# EAGLE design SERV (EAGLE 9.4.2)
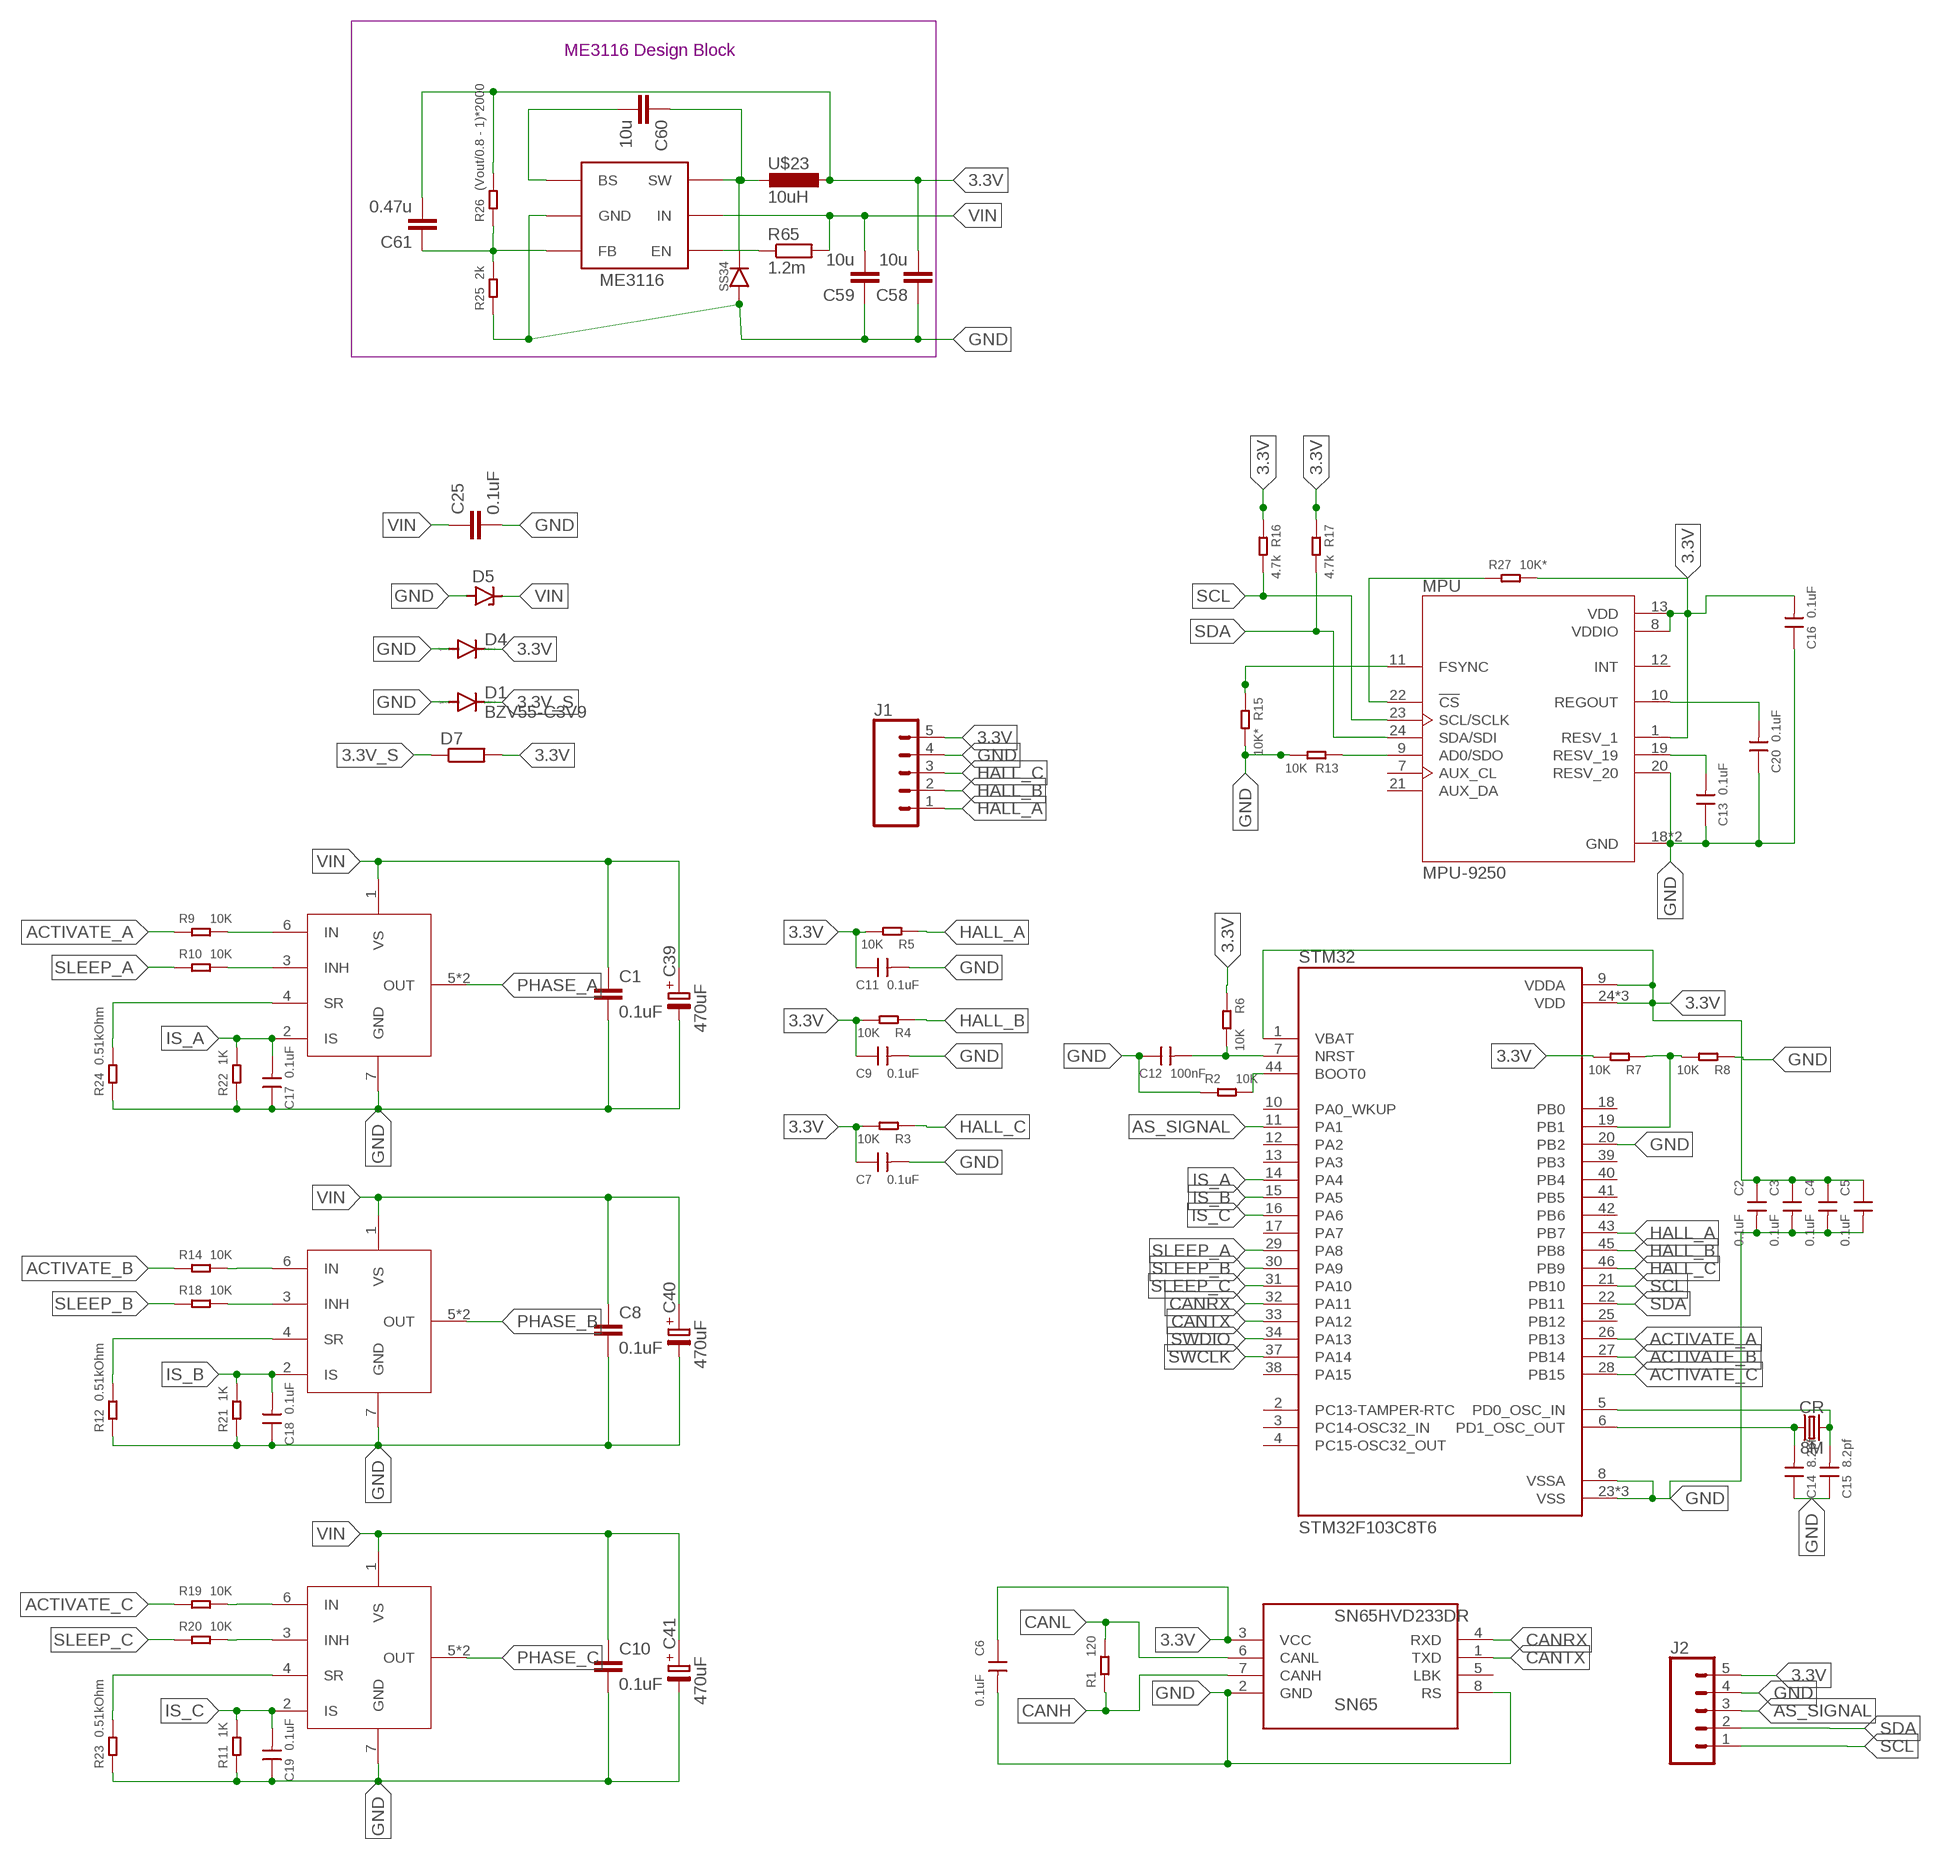
[diagram p0: schematic, sheet 1]

## Parts
BTN_A  BTN7960B  [DPAK127P1500X440-8N]
BTN_B  BTN7960B  [DPAK127P1500X440-8N]
BTN_C  BTN7960B  [DPAK127P1500X440-8N]
C1  0.1uF  C-EUC1206  [C1206]
C2  0.1uF  C-0603  [0603]
C3  0.1uF  C-0603  [0603]
C4  0.1uF  C-0603  [0603]
C5  0.1uF  C-0603  [0603]
C6  0.1uF  C-0603  [0603]
C7  0.1uF  C-0603  [0603]
C8  0.1uF  C-EUC1206  [C1206]
C9  0.1uF  C-0603  [0603]
C10  0.1uF  C-EUC1206  [C1206]
C11  0.1uF  C-0603  [0603]
C12  100nF  C-0603  [0603]
C13  0.1uF  C-0603  [0603]
C14  8.2pf  C-0603  [0603]
C15  8.2pf  C-0603  [0603]
C16  0.1uF  C-0603  [0603]
C17  0.1uF  C-0603  [0603]
C18  0.1uF  C-0603  [0603]
C19  0.1uF  C-0603  [0603]
C20  0.1uF  C-0603  [0603]
C25  0.1uF  C-EUC1206  [C1206]
C39  470uF  C-PR-SMD-TE-D  [TE-D-7343]
C40  470uF  C-PR-SMD-TE-D  [TE-D-7343]
C41  470uF  C-PR-SMD-TE-D  [TE-D-7343]
C58  10u  C-EUC0805  [C0805]
C59  10u  C-EUC0805  [C0805]
C60  10u  C-EUC0805  [C0805]
C61  0.47u  C-EUC0805  [C0805]
CR  8M  CRYSTALSMD-3.2X2.5  [CRYSTAL-SMD-3.2X2.5MM]
D1  BZV55-C3V9  DIODE-MINIMELF  [MINIMELF]
D4  DIODE-MINIMELF  [MINIMELF]
D5  ZENER-DIODESMB  [SMB]
D7  R-EU_R0805W  [R0805W]
J1  CONN_05  [1X05]
J2  CONN_05  [1X05]
ME311  ME3116  [SOT-23-6]
MPU  MPU-9250  [QFN40P300X300X105-24N]
R1  120  R-0603  [0603]
R2  10K  R-0603  [0603]
R3  10K  R-0603  [0603]
R4  10K  R-0603  [0603]
R5  10K  R-0603  [0603]
R6  10K  R-0603  [0603]
R7  10K  R-0603  [0603]
R8  10K  R-0603  [0603]
R9  10K  R-0603  [0603]
R10  10K  R-0603  [0603]
R11  1K  R-0603  [0603]
R12  0.51kOhm  R-0603  [0603]
R13  10K  R-0603  [0603]
R14  10K  R-0603  [0603]
R15  10K*  R-0603  [0603]
R16  4.7k  R-0603  [0603]
R17  4.7k  R-0603  [0603]
R18  10K  R-0603  [0603]
R19  10K  R-0603  [0603]
R20  10K  R-0603  [0603]
R21  1K  R-0603  [0603]
R22  1K  R-0603  [0603]
R23  0.51kOhm  R-0603  [0603]
R24  0.51kOhm  R-0603  [0603]
R25  2k  R-0603  [0603]
R26  (Vout/0.8 - 1)*2000  R-0603  [0603]
R27  10K*  R-0603  [0603]
R65  1.2m  R-EU_R0603  [R0603]
SN65  SN65HVD233DR  [SOIC8]
STM32  STM32F103C8T6  [QFP50P900X900X160-48N]
U$1  SMA-SS34  [SMA-SS34]
U$23  10uH  INDUCTOR_CD43  [CD43]

## Nets
3.3V: C2.1 C3.1 C4.1 C5.1 C6.1 C7.1 C9.1 C11.1 C16.2 C58.2 C61.2 D4.C D7.2 J1.5 J2.5 MPU.1(RESV_1) MPU.8(VDDIO) MPU.13(VDD) R3.2 R4.2 R5.2 R6.1 R7.2 R16.1 R17.1 R26.2 R27.2 SN65.3(VCC) STM32.1(VBAT) STM32.9(VDDA) STM32.24(VDD) STM32.36(VDD) STM32.48(VDD) U$23.P$1
3.3V_S: D1.C D7.1
ACTIVATE_A: R9.1 STM32.26(PB13)
ACTIVATE_B: R14.1 STM32.27(PB14)
ACTIVATE_C: R19.1 STM32.28(PB15)
AS_SIGNAL: J2.3 STM32.11(PA1)
CANH: R1.1 SN65.7(CANH)
CANL: R1.2 SN65.6(CANL)
CANRX: SN65.4(RXD) STM32.32(PA11)
CANTX: SN65.1(TXD) STM32.33(PA12)
GND: BTN_A.7(GND) BTN_B.7(GND) BTN_C.7(GND) C1.2 C2.2 C3.2 C4.2 C5.2 C6.2 C7.2 C8.2 C9.2 C10.2 C11.2 C12.1 C13.1 C14.1 C15.1 C16.1 C17.1 C18.1 C19.1 C20.1 C25.2 C39.- C40.- C41.- C58.1 C59.1 D1.A D4.A D5.A J1.4 J2.4 ME311.2(GND) MPU.18(GND) MPU.20(RESV_20) MPU.25(GND) R2.1 R8.1 R11.1 R12.1 R13.2 R15.2 R21.1 R22.1 R23.1 R24.1 R25.1 SN65.2(GND) SN65.8(RS) STM32.8(VSSA) STM32.20(PB2) STM32.23(VSS) STM32.35(VSS) STM32.47(VSS) U$1.1(IN)
HALL_A: J1.1 R5.1 STM32.43(PB7)
HALL_B: J1.2 R4.1 STM32.45(PB8)
HALL_C: J1.3 R3.1 STM32.46(PB9)
IS_A: BTN_C.2(IS) C17.2 R22.2 STM32.14(PA4)
IS_B: BTN_B.2(IS) C18.2 R21.2 STM32.15(PA5)
IS_C: BTN_A.2(IS) C19.2 R11.2 STM32.16(PA6)
N$1: MPU.9(AD0/SDO) R13.1
N$2: R2.2 STM32.44(BOOT0)
N$3: C20.2 MPU.10(REGOUT)
N$4: MPU.22(!CS) R27.1
N$26: BTN_C.4(SR) R24.2
N$27: BTN_B.6(IN) R14.2
N$28: BTN_B.4(SR) R12.2
N$29: BTN_A.6(IN) R19.2
N$30: BTN_A.4(SR) R23.2
N$31: BTN_B.3(INH) R18.2
N$37: BTN_A.3(INH) R20.2
N$38: C13.2 MPU.19(RESV_19)
N$48: MPU.11(FSYNC) R15.1
N$51: C15.2 CR.3 STM32.5(PD0_OSC_IN)
N$52: C14.2 CR.1 STM32.6(PD1_OSC_OUT)
N$54: C12.2 R6.2 STM32.7(NRST)
N$56: BTN_C.6(IN) R9.2
N$57: BTN_C.3(INH) R10.2
N$61: R7.1 R8.2 STM32.19(PB1)
N$62: C60.2 ME311.1(BS)
N$63: C61.1 ME311.3(FB) R25.2 R26.1
N$64: ME311.4(EN) R65.1
N$66: C60.1 ME311.6(SW) U$1.2(OUT) U$23.P$2
PHASE_A: BTN_C.5(OUT) BTN_C.8(OUT)
PHASE_B: BTN_B.5(OUT) BTN_B.8(OUT)
PHASE_C: BTN_A.5(OUT) BTN_A.8(OUT)
SCL: J2.1 MPU.23(SCL/SCLK) R16.2 STM32.21(PB10)
SDA: J2.2 MPU.24(SDA/SDI) R17.2 STM32.22(PB11)
SLEEP_A: R10.1 STM32.29(PA8)
SLEEP_B: R18.1 STM32.30(PA9)
SLEEP_C: R20.1 STM32.31(PA10)
SWCLK: STM32.37(PA14)
SWDIO: STM32.34(PA13)
VIN: BTN_A.1(VS) BTN_B.1(VS) BTN_C.1(VS) C1.1 C8.1 C10.1 C25.1 C39.+ C40.+ C41.+ C59.2 D5.C ME311.5(IN) R65.2
Unconnected: MPU.7(AUX_CL) MPU.12(INT) MPU.21(AUX_DA) SN65.5(LBK) STM32.2(PC13-TAMPER-RTC) STM32.3(PC14-OSC32_IN) STM32.4(PC15-OSC32_OUT) STM32.10(PA0_WKUP) STM32.12(PA2) STM32.13(PA3) STM32.17(PA7) STM32.18(PB0) STM32.25(PB12) STM32.38(PA15) STM32.39(PB3) STM32.40(PB4) STM32.41(PB5) STM32.42(PB6)

## Notes on the sheet
- Фитолента
- ME3116 Design Block

## Library data of the parts
BTN_A BTN_B BTN_C = DDPAK127P1500X440-8N:BTN7960B
C1 C8 C10 C25 C58-C61 = resistor:C-EU: CAPACITOR, European symbol
C2-C7 C9 C11-C20 = discrete:C*: Ceramic Capacitors
C39-C41 = cap-pan40:C-PR: POLARIZED ELECTROLYTIC/TANTALUM
CR = SparkFun-Clocks:CRYSTAL: Crystals (Generic) These are passive quartz crystals, which can be used as a clock source for a microcontroller. Crystal's are two-terminal devices. They require external "load" capacitors to generate an oscillating signal.
D1 D4 = diode:DIODE-: DIODE
D5 = diode:ZENER-DIODE: Z-Diode
D7 R65 = resistor:R-EU_: RESISTOR, European symbol
J1 J2 = SparkFun-Connectors:CONN_05: Multi connection point. Often used as Generic Header-pin footprint for 0.1 inch spaced/style header connections On any of the 0.1 inch spaced packages, you can populate with these: Break Away Headers - Straight <https://www.sparkfun.com/products/116> (PRT-00116) Break Away Male Headers - Right Angle <https://www.sparkfun.com/products/553> (PRT-00553) Female Headers <https://www.sparkfun.com/products/115> (PRT-00115) Break Away Headers - Machine Pin <https://www.sparkfun.com/products/117> (PRT-00117) Break Away Female Headers - Swiss Machine Pin <https://www.sparkfun.com/products/743> (PRT-00743) For SCREWTERMINALS and SPRING TERMINALS visit here: Screw Terimnals on SparkFun.com <https://www.sparkfun.com/search/results?term=Screw+Terminals> (5mm/3.5mm/2.54mm spacing) This device is also useful as a general connection point to wire up your design to another part of your project. Our various solder wires solder well into these plated through hole pads. Hook-Up Wire - Assortment (Stranded, 22 AWG) <https://www.sparkfun.com/products/11375> (PRT-11375) Hook-Up Wire - Assortment (Solid Core, 22 AWG) <https://www.sparkfun.com/products/11367> (PRT-11367) View the entire wire category on our website here <https://www.sparkfun.com/categories/141> Special notes: Molex polarized connector foot print use with SKU : PRT-08231 with associated crimp pins and housings. 1MM SMD Version SKU: PRT-10208
ME311 = ME3116:ME3116
MPU = MPU-9250:MPU-9250: Axis=3 Axis Gyro+3 Axis Accel+Compass. Pin For Pin With m; AVAILABILITY: Unavailable; DESCRIPTION: Accelerometer, Gyroscope, Magnetometer, 9 Axis Sensor I²C, SPI Output; MF: TDK InvenSense; MP: MPU-9250; PACKAGE: TFQFN-24 TDK InvenSense; PRICE: None
R1-R27 = discrete:R*
SN65 = SN65HVD233DR:SN65HVD233DR; AVAILABILITY: Unavailable; DESCRIPTION: 3.3V CAN Transceiver with Standby Mode, Loop-back 8-SOIC -40 to 125; MF: Texas Instruments; MP: SN65HVD233DR; PACKAGE: SOIC-8 Texas Instruments; PRICE: None
STM32 = STM32F103C8T6:STM32F103C8T6: Mainstream Performance line, ARM Cortex-M3 MCU with 64 Kbytes Flash, 72 MHz CPU, motor control, USB and CAN; AVAILABILITY: Unavailable; DESCRIPTION: ARM® Cortex®-M3 STM32F1 Microcontroller IC 32-Bit 72MHz 64KB _64K x 8_ FLASH; MF: STMicroelectronics; MP: STM32F103C8T6; PACKAGE: LQFP-48 STMicroelectronics; PRICE: None
U$1 = SMA-SS34:SMA-SS34
U$23 = inductor_cd43:INDUCTOR_CD43

## Board
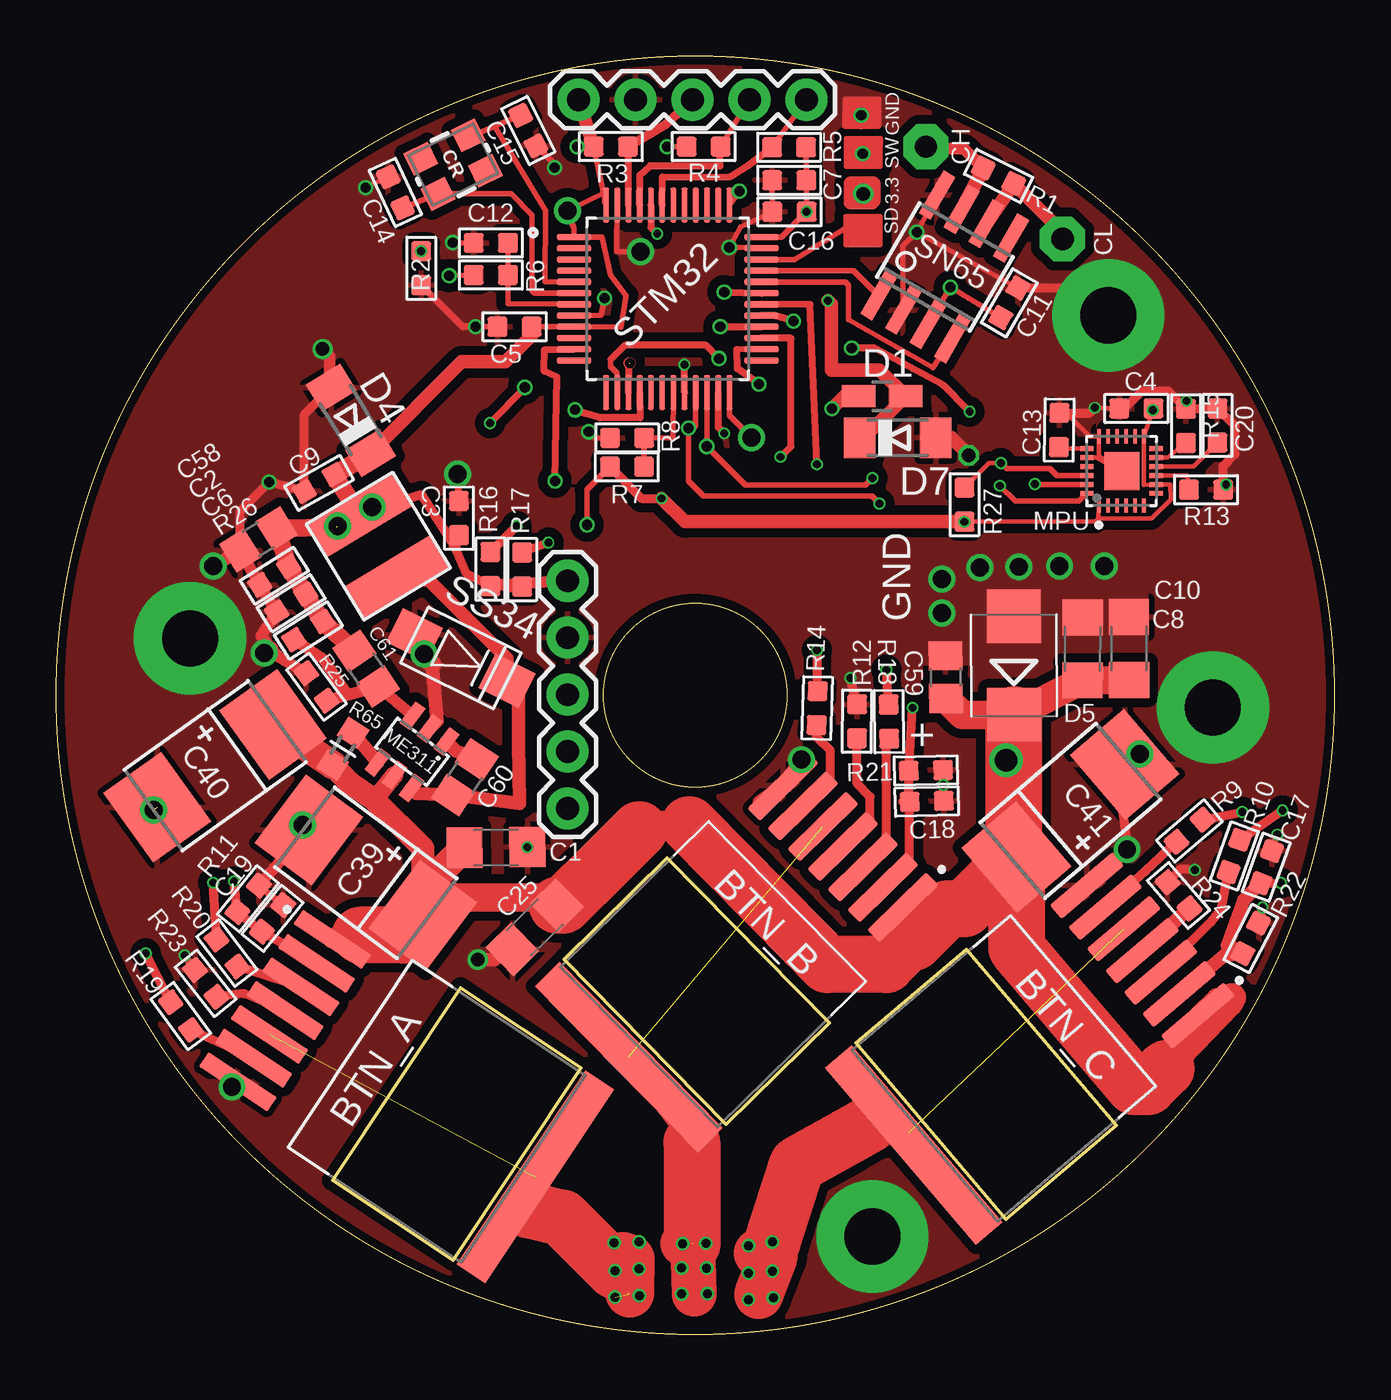
[diagram p1: board, top side]
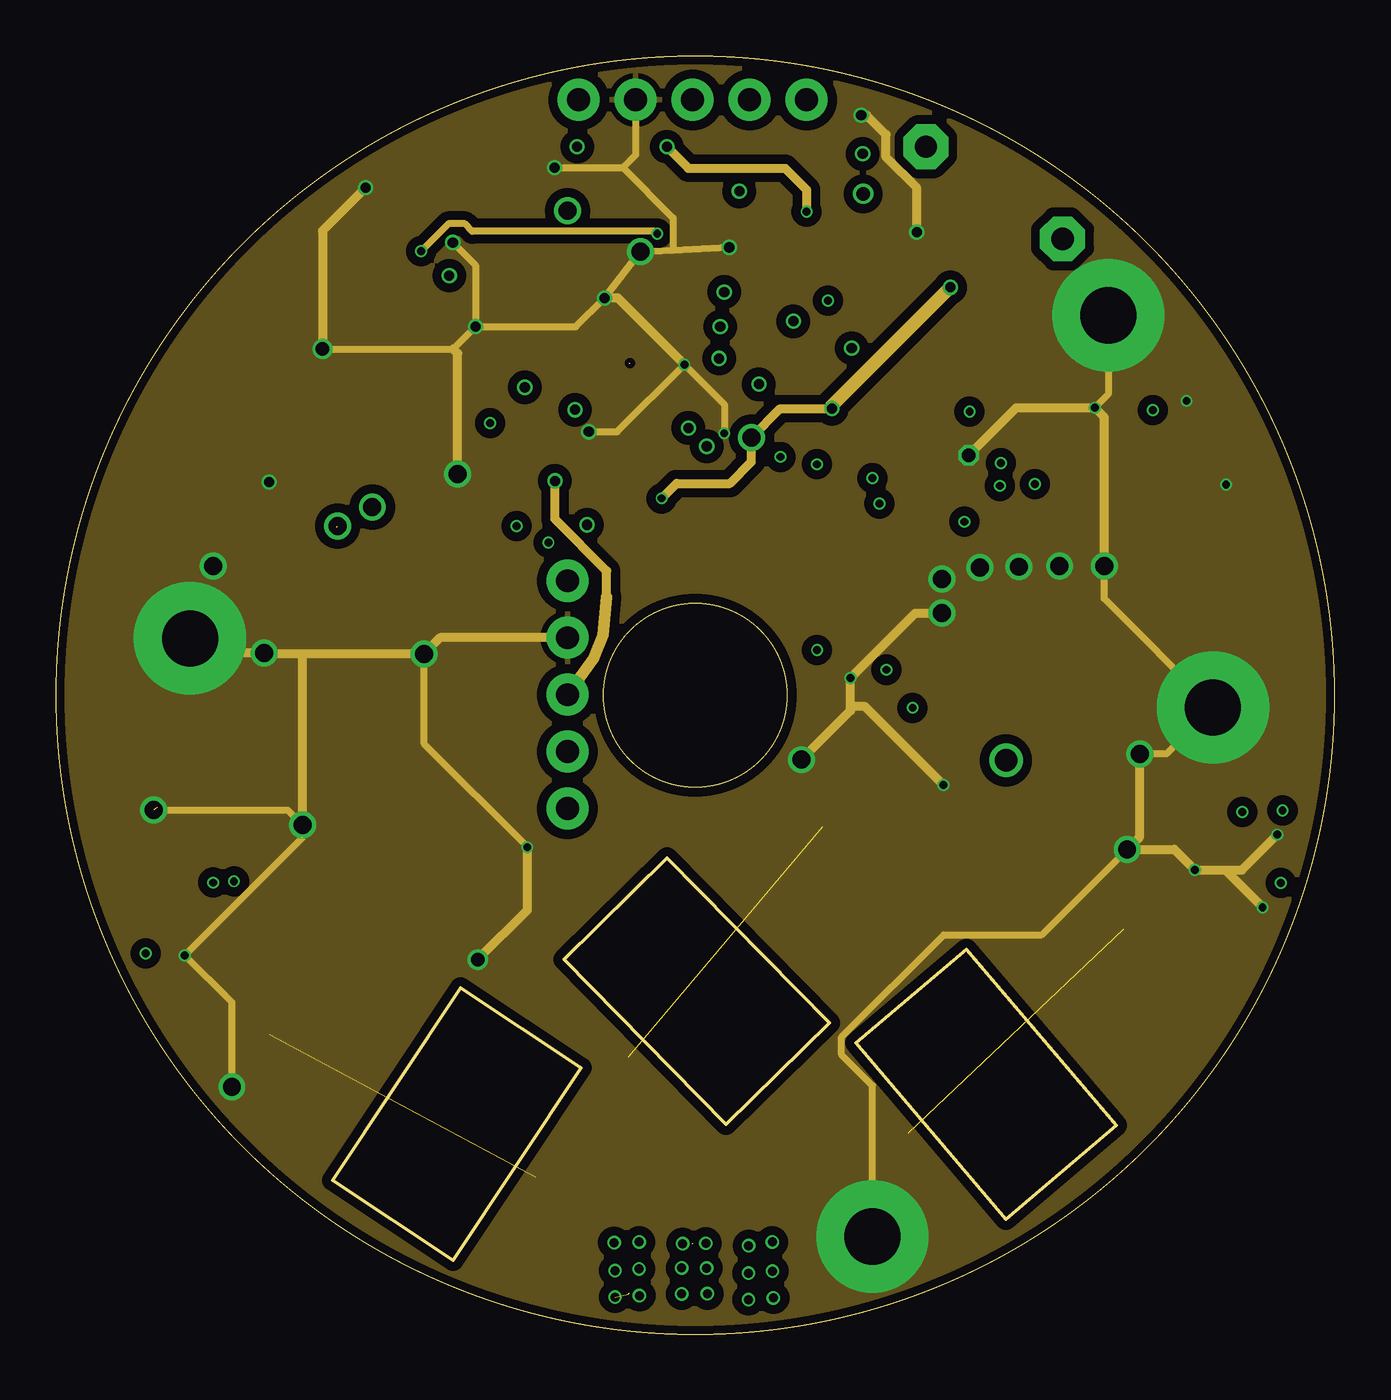
[diagram p2: board, inner layer Route2]
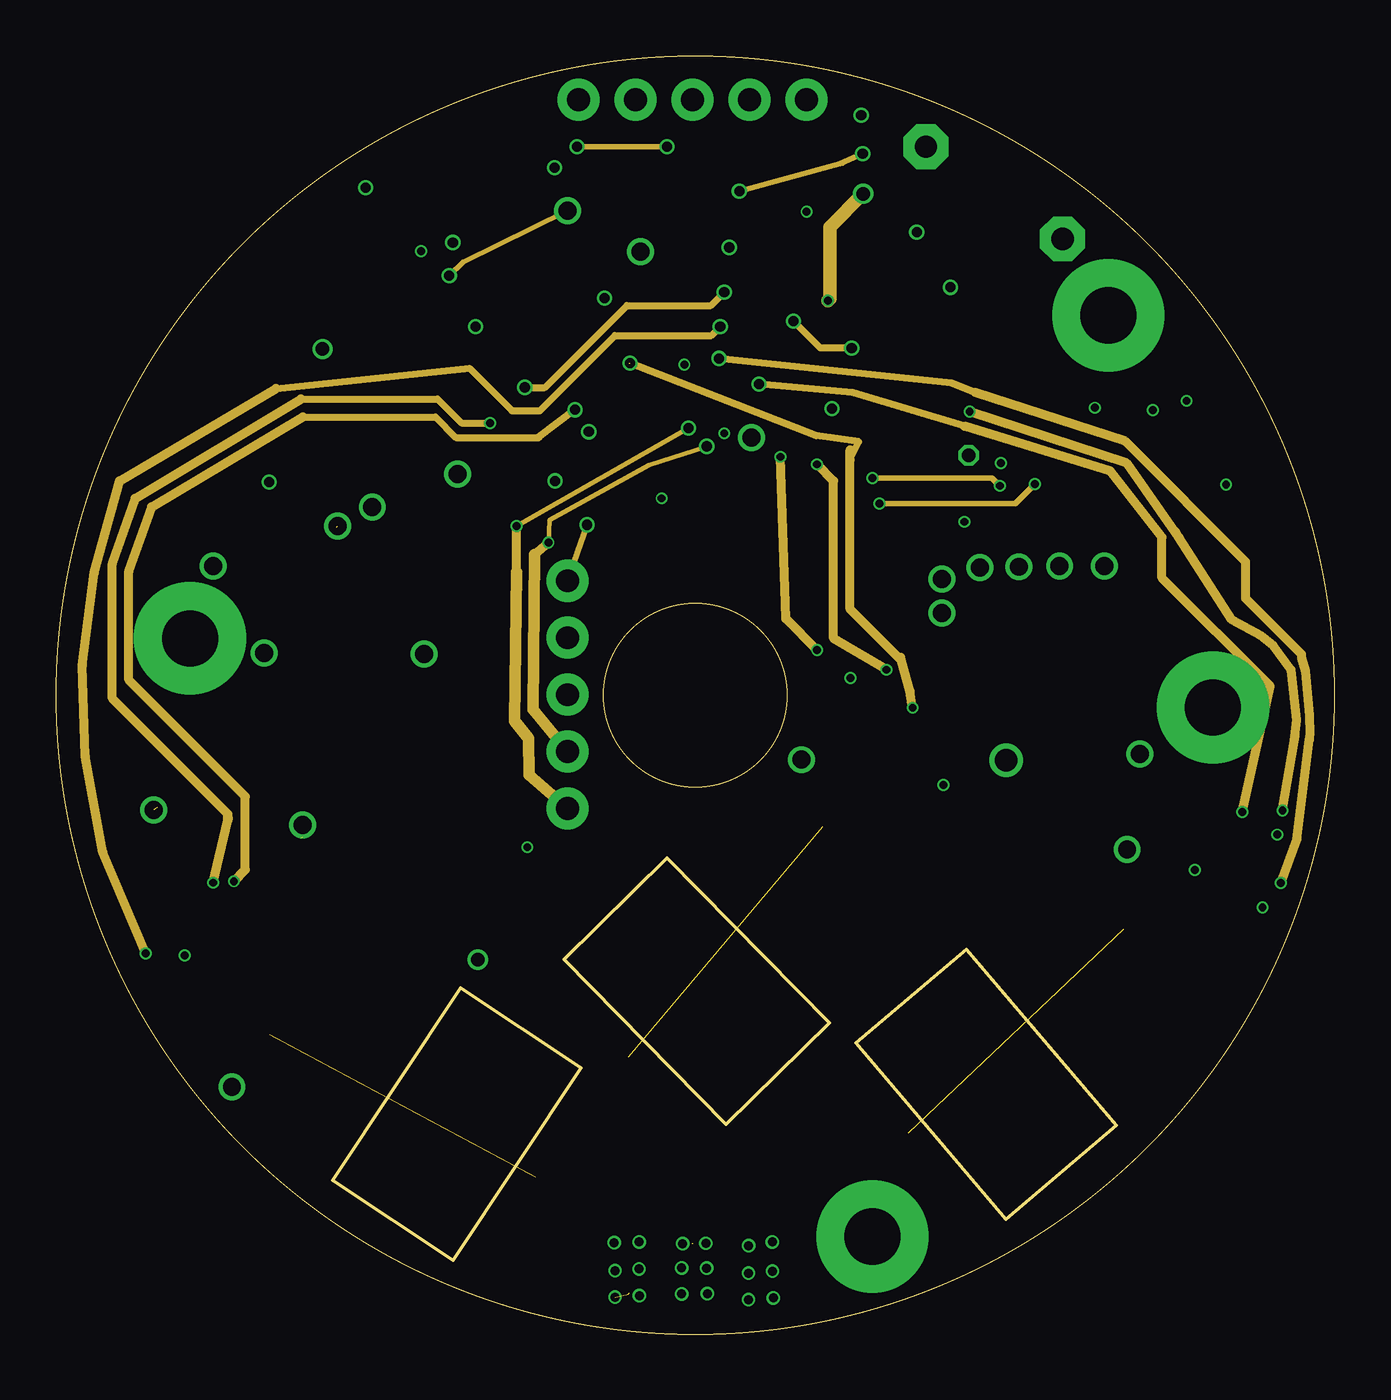
[diagram p3: board, inner layer Route15]
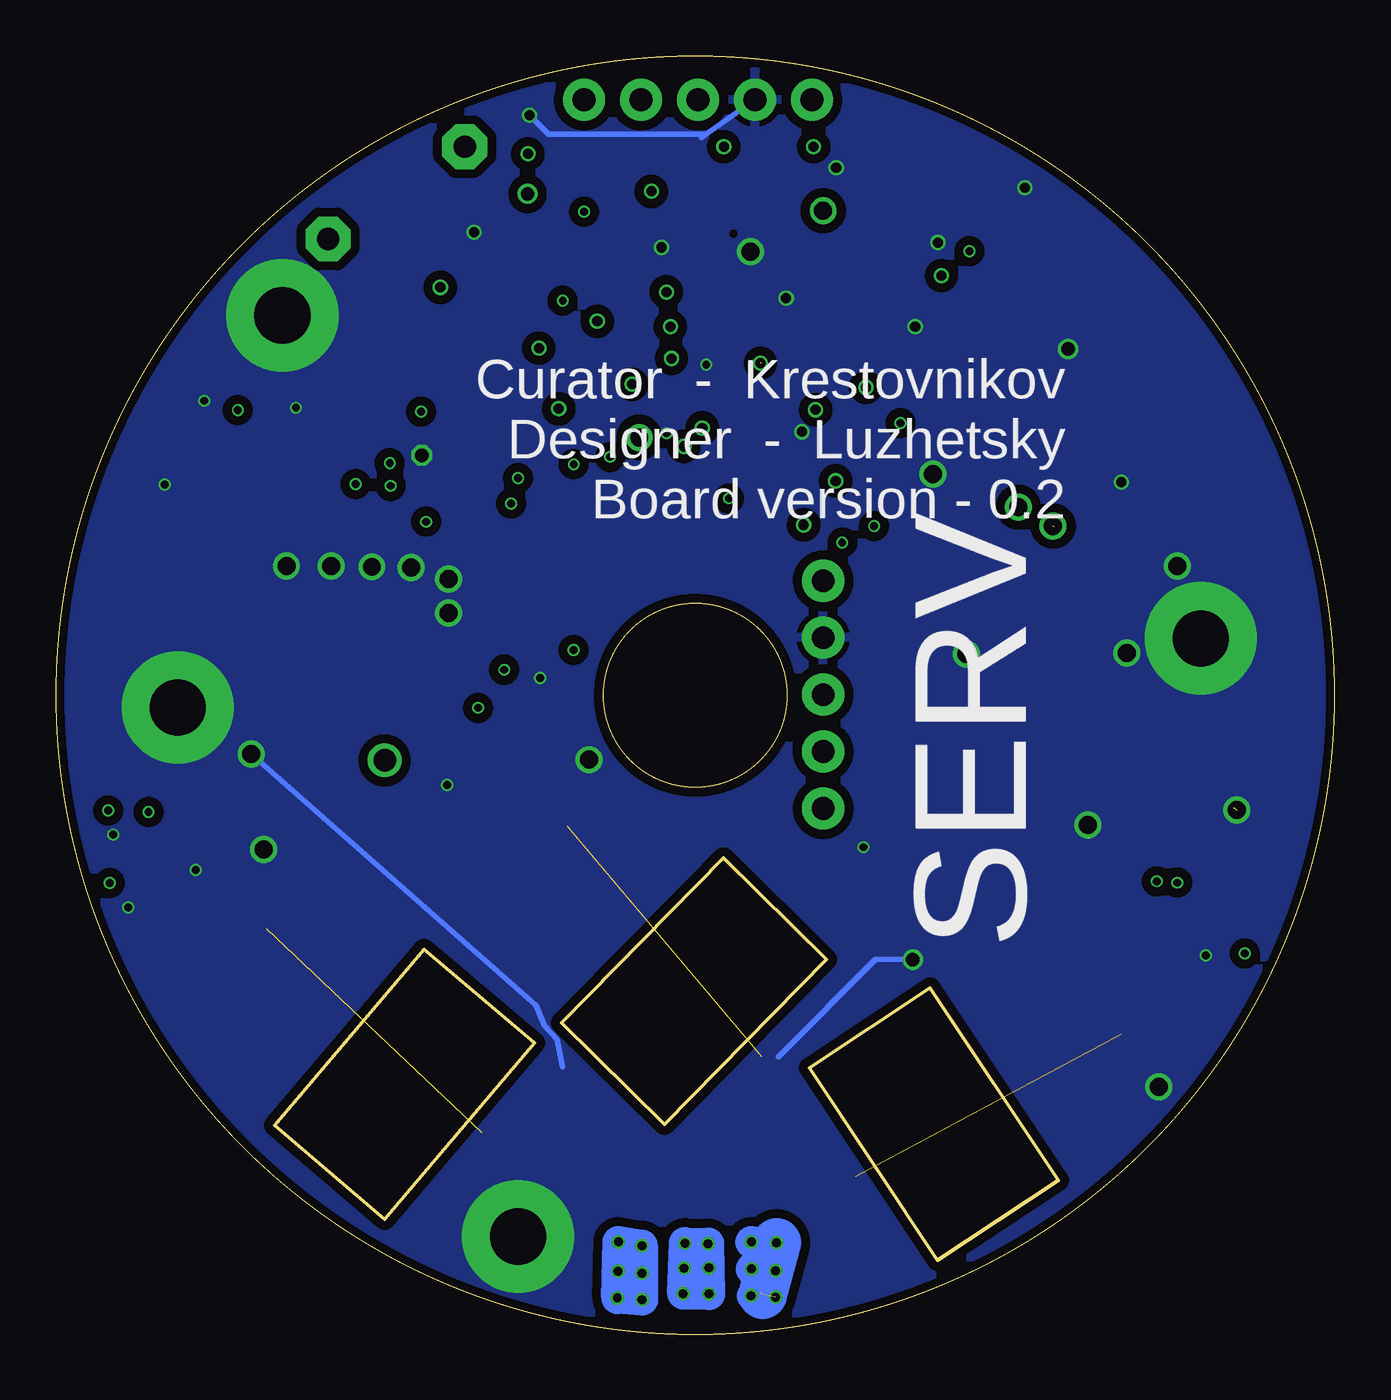
[diagram p4: board, bottom side, seen from below]

Size 57 x 57 mm. Coordinates in mm from the lower left corner, seen from the top.
Outline: circle at 28.5,28.5 radius 4.1
Outline: circle at 28.5,28.5 radius 28.5
Copper layers (1*2*15*16): Top 0.035mm / dielectric 1.6mm / Route2 0.035mm / dielectric 0.15mm / Route15 0.035mm / dielectric 0.2mm / Bottom 0.035mm
Design rules "jlcpcb": minimum track width 5mil, minimum drill 0.2mm, track to track 5mil, track to pad 5mil, pad to pad 5mil, via to via 5mil, smd to smd 0mil, copper to edge 0.4mm, drill to drill 8mil, minimum pad ring 0.075mm, minimum via ring 0.075mm, stop-mask expansion 4mil, vias tented up to drill 0mil, thermal gap 10mil

### Footprints (pad centres in the part's own frame; a part is rotated, then mirrored left to right if it is on the bottom)
DPAK127P1500X440-8N = smd 3.67 x 0.79: 1 -6.07,3.81; 2 -6.07,2.54; 3 -6.07,1.27; 4 -6.07,0; 5 -6.07,-1.27; 6 -6.07,-2.54; 7 -6.07,-3.81 | smd 1.538 x 10.37: 8 7.319,0
C1206 = smd 1.6 x 1.8: 1 -1.4,0; 2 1.4,0
0603 = smd 0.889 x 0.889: 1 -0.762,0; 2 0.762,0
TE-D-7343 = smd 3.175 x 3.81: + 3.175,0; - -3.175,0
C0805 = smd 1.3 x 1.5: 1 -0.95,0; 2 0.95,0
CRYSTAL-SMD-3.2X2.5MM = smd 1.2 x 1.1: 1 -1.175,-0.875; 2 1.175,-0.875; 3 1.175,0.875; 4 -1.175,0.875
MINIMELF = smd 1.4 x 1.8: A 1.7,0; C -1.7,0
SMB = smd 2.4 x 2.4: A 2.2,0; C -2.2,0
R0805W = smd 1.5 x 1: 1 -1.052,0; 2 1.052,0
1X05 = drill 1.016 pad 1.88: 1 0,0; 2 2.54,0; 3 5.08,0; 4 7.62,0; 5 10.16,0
SOT-23-6 = smd 0.55 x 1.2: 1 -0.95,-1.3; 2 0,-1.3; 3 0.95,-1.3; 4 0.95,1.3; 5 0,1.3; 6 -0.95,1.3
QFN40P300X300X105-24N = smd 0.64 x 0.22: 1 -1.545,1; 2 -1.545,0.6; 3 -1.545,0.2; 4 -1.545,-0.2; 5 -1.545,-0.6; 6 -1.545,-1; 13 1.545,-1; 14 1.545,-0.6; 15 1.545,-0.2; 16 1.545,0.2; 17 1.545,0.6; 18 1.545,1 | smd 0.22 x 0.64: 7 -1,-1.545; 8 -0.6,-1.545; 9 -0.2,-1.545; 10 0.2,-1.545; 11 0.6,-1.545; 12 1,-1.545; 19 1,1.545; 20 0.6,1.545; 21 0.2,1.545; 22 -0.2,1.545; 23 -0.6,1.545; 24 -1,1.545 | smd 1.7 x 1.55: 25 0,-0.01
R0603 = smd 1 x 1.1: 1 -0.85,0; 2 0.85,0
SOIC8 = smd 0.6 x 2.2: 1 -1.905,-2.6; 2 -0.635,-2.6; 3 0.635,-2.6; 4 1.905,-2.6; 5 1.905,2.6; 6 0.635,2.6; 7 -0.635,2.6; 8 -1.905,2.6
QFP50P900X900X160-48N = smd 1.56 x 0.28: 1 -4.18,2.75; 2 -4.18,2.25; 3 -4.18,1.75; 4 -4.18,1.25; 5 -4.18,0.75; 6 -4.18,0.25; 7 -4.18,-0.25; 8 -4.18,-0.75; 9 -4.18,-1.25; 10 -4.18,-1.75; 11 -4.18,-2.25; 12 -4.18,-2.75; 25 4.18,-2.75; 26 4.18,-2.25; 27 4.18,-1.75; 28 4.18,-1.25; 29 4.18,-0.75; 30 4.18,-0.25; 31 4.18,0.25; 32 4.18,0.75; 33 4.18,1.25; 34 4.18,1.75; 35 4.18,2.25; 36 4.18,2.75 | smd 0.28 x 1.56: 13 -2.75,-4.18; 14 -2.25,-4.18; 15 -1.75,-4.18; 16 -1.25,-4.18; 17 -0.75,-4.18; 18 -0.25,-4.18; 19 0.25,-4.18; 20 0.75,-4.18; 21 1.25,-4.18; 22 1.75,-4.18; 23 2.25,-4.18; 24 2.75,-4.18; 37 2.75,4.18; 38 2.25,4.18; 39 1.75,4.18; 40 1.25,4.18; 41 0.75,4.18; 42 0.25,4.18; 43 -0.25,4.18; 44 -0.75,4.18; 45 -1.25,4.18; 46 -1.75,4.18; 47 -2.25,4.18; 48 -2.75,4.18
SMA-SS34 = smd 2 x 1.7: 1 -2.27,-0.13; 2 2.33,-0.13
CD43 = smd 4.5 x 1.75: P$1 2.25,0.87; P$2 2.22,4.15

### Placement (x,y rotation side)
BTN_A  15.27,11.08 326.4 top
BTN_B  30.75,17.5 224.5 top
BTN_C  43.81,13.19 220.4 top
C1  19.61,21.72 0.5 top
C2  9.73,33.83 212 top
C3  17.96,36.4 90.2 top
C4  48.16,41.29 180 top
C5  20.44,44.93 180 top
C6  10.48,32.61 212.1 top
C7  32.69,51.46 180 top
C8  47.83,30.59 90.1 top
C9  11.73,37.97 209.4 top
C10  45.76,30.57 89.9 top
C11  42.5,46 59.8 top
C12  19.38,48.67 0 top
C13  44.72,40.33 269.1 top
C14  15.13,50.92 294.8 top
C15  21.05,53.68 116.7 top
C16  32.7,50.06 0 top
C17  53.95,20.84 250.1 top
C18  38.82,23.77 181.6 top
C19  9.65,18.56 231 top
C20  51.78,40.53 270 top
C25  21.34,18.16 224.5 top
C39  13.81,20.59 323.2 top
C40  7.09,25.36 35.6 top
C41  45.23,23.35 220.5 top
C58  9.02,35.45 31.7 top
C59  39.66,29.31 271 top
C60  18.23,24.85 56.4 top
C61  13.83,29.69 123.8 top
CR  17.7,52.16 26.3 top
D1  37.52,39.98 0 top
D4  13.14,40.76 121.2 top
D5  42.7,29.83 90.2 top
D7  36.83,41.84 180 top
J1  33.46,55.05 180 top
J2  22.8,23.45 90 top
ME311  15.87,25.98 143.1 top
MPU  47.5,38.5 90 top
R1  42.02,51.66 333.1 top
R2  16.28,47.54 90 top
R3  24.73,52.96 180 top
R4  28.87,52.96 180 top
R5  32.68,52.93 0 top
R6  19.38,47.24 0 top
R7  25.45,38.69 180 top
R8  25.46,39.97 0 top
R9  50.53,22.46 220.4 top
R10  52.53,21.34 250.2 top
R11  8.56,19.43 231 top
R12  35.71,27.34 269.8 top
R13  51.27,37.67 0 top
R14  33.93,27.93 268.2 top
R15  50.37,40.51 90 top
R16  19.37,34.13 90 top
R17  20.78,34.11 90 top
R18  37.13,27.33 270.8 top
R19  5.56,14.2 306.2 top
R20  7.62,17.01 307.6 top
R21  38.78,25.15 181.3 top
R22  53.26,17.66 242.5 top
R23  6.67,15.66 308.4 top
R24  50.04,19.58 310.4 top
R25  11.61,28.88 306.5 top
R26  11.25,31.39 32.3 top
R27  40.5,37 270 top
R65  12.79,26.11 237.8 top
SN65  39.62,47.6 329.8 top
STM32  27.27,46.18 0 top
U$1  18.08,30.3 333.6 top
U$23  15.01,38.45 211 top

### Tracks (layer width: path | path; a pad name or v marks a point on that pad's centre or on a via)
3.3V  (via drill 0.35, 0.45, 0.8)  (1 unrouted)
  Top 0.152: U$23.P$1 13.74,36.76 14.02,36.76 | U$23.P$1 13.87,36.89 v14.1,36.89 | STM32.48 24.41,50.47 24.41,50.88 | U$23.P$1 12.98,36 12.5,36
  Top 0.203: 46.47,36.37 48.83,36.39 48.93,36.47 49.69,37.23 49.67,37.9 MPU.8 48.5,37.88 MPU.13 v48.9,41.22 C4.1 | 46.47,36.37 MPU.1 | R27.2 46.34,36.24 46.47,36.37
  Top 0.254: R4.2 v27.23,52.96 | v23.23,52.96 R3.2 24.41,50.88 v22.8,50.1 23.09,49.3 STM32.1 24.35,48.93 24.71,47.24 25.42,46.32 25.19,44.92 STM32.9 C5.1 | R5.2 C7.1 C16.2 32.33,48.93 STM32.36 | SN65.3 v39.87,46.69 C11.1 | 24.47,50.6 STM32.48 | R6.1 v17.53,47.21 | STM32.24 30.02,40.98 v31,40 | R7.2 23.67,37.67 v23.67,36.1
  Top 0.406: R16.1 18.31,33.91 17.76,35.15 16.3,37.45 13.94,36.68 U$23.P$1 | R7.2 26.1,37.28 v27,37.28
  Top 0.508: 20,33.44 19.83,33.43 19.43,33.43 R16.1 | 20,33.44 J2.5 | C3.1 17.76,35.15 | 14.02,36.76 13.94,36.68 | R17.1 20.09,33.35 20,33.44
  Top 0.61: J1.5 R3.2 | D7.2 35.15,41.84 v34.59,41.28 | R27.2 28.04,36.24 v27,37.28 | D4.C 18.09,43.37 20.03,43.37 21.2,44.54 C5.1
  Top 0.813: C61.2 R26.2 C6.1 C2.1 C58.2 12.5,36 13.42,36.49 U$23.P$1 C9.1 D4.C
  Route2 0.406: v27,37.28 27.67,37.95 30.04,37.95 31,38.91 v31,40 32.28,41.28 v34.59,41.28 | v27.23,52.96 28.19,52 32.5,52 33.46,51.04 C16.2
  Route2 0.61: v39.87,46.69 34.59,41.41 v34.59,41.28
  Route15 0.254: v27.23,52.96 v23.23,52.96 | v22.8,50.1 18.14,47.82 v17.53,47.21 | v23.67,36.1 J2.5
  other vias: 12.55,36.05 33.46,50.06 40.5,36.24
3.3V_S  (via drill 0.35, 0.6)
  Top 0.61: D1.C 36.02,39.98 D7.1 36.71,43.01 34.56,43.01 34.56,45.95 v34.41,46.1 | v35.98,50.86 35.98,51.29 35.97,51.3 36.46,51.3 36.47,51.29 36.47,50.55 36.39,50.47 35.42,50.47 35.42,51.34 36.43,51.34 36.47,51.3
  Route15 0.61: v34.41,46.1 34.5,46.19 34.5,49.38 v35.98,50.86
ACTIVATE_A  (via drill 0.35, 0.45)
  Top 0.254: 30.35,43.93 STM32.26
  Top 0.305: v31.33,42.37 30.37,43.06 30.35,43.93
  Top 0.406: R9.1 v52.88,23.3
  Route15 0.305: 40.5,40.5 35.5,42 v31.33,42.37
  Route15 0.406: 40.5,40.5 47,38.5 49.3,35.55 49.3,33.73 54.13,28.91 v52.88,23.3 | 40.5,40.5
ACTIVATE_B  (via drill 0.35)
  Top 0.305: STM32.27 32.77,44.42 32.77,39.6 v32.3,39.13
  Top 0.406: R14.1 33.95,30.5 v33.93,30.52
  Route15 0.406: v32.3,39.13 32.53,31.92 v33.93,30.52
ACTIVATE_C  (via drill 0.35, 0.45)
  Top 0.305: v29.61,44.94 STM32.28
  Top 0.406: R19.1 v4,17
  Route15 0.305: 9.8,42.18 18.43,43.08 20.32,41.19 21.57,41.19 24.92,44.54 29.21,44.54 v29.61,44.94
  Route15 0.406: v4,17 2.08,21.5 1.31,25.78 1.17,29.82 1.7,33.97 2.83,38.06 9.8,42.18
AS_SIGNAL  (via drill 0.45)
  Top 0.305: v22.24,38.06 22.29,40.49 22.33,42.69 21.76,42.95 21.77,43.91 STM32.11
  Route2 0.406: v22.24,38.06 22.24,36.36 24.55,34.05 24.55,32.88
  Route2 0.508: J2.3 23.97,30.14 24.39,31.18 24.55,32.88
CANH  (via drill 1 pad 2)
  Top 0.508: R1.1 40.48,52.87 38.87,52.87
  Top 0.61: SN65.7 R1.1 41.26,52.01 | 38.87,52.87 v38.78,52.96
CANL  (via drill 1 pad 2)
  Top 0.61: SN65.6 R1.2 44.87,49.15 v44.87,48.85
CANRX
  Top 0.254: SN65.4 39.1,43.1 35.33,45.26 35.33,46.8 35.2,46.93 STM32.32
CANTX
  Top 0.254: SN65.1 35.55,47.43 STM32.33
GND  (via drill 0.35, 0.45, 0.6, 0.8, 2.5 pad 5)  (2 unrouted)
  Top 0.152: 12.19,43.63 12.16,43.66
  Top 0.203: 44.48,40.84 C13.1 45.04,41.09 46.09,40.05 MPU.18 46.5,39.1 MPU.20 | v50.4,41.63 50.37,41.6 R15.2 | C4.2 v46.31,41.32 | v52.16,37.9 52.16,37.8 R13.2
  Top 0.254: v35.9,54.37 35.89,53.86 36.67,53.88 36.69,55.07 35.19,55.07 35.18,53.88 35.92,53.87 36.47,53.88 36.5,54.88 35.39,54.86 35.4,54.04 36.31,54.04 36.29,54.67 35.58,54.67 35.58,54.25 36.1,54.24 36.09,54.47 35.77,54.48 | v38.37,49.16 SN65.8 | C11.2 v38.37,49.16 | STM32.47 24.99,48.28 v26.05,48.28 | v22.22,52.02 22.22,52.17 C15.1 | C12.1 v17.69,48.69 | C14.1 v13.8,51.13 | STM32.8 24.3,45.45 v24.45,46.21 | C5.2 v18.7,44.93 | R8.1 24.03,39.97 v23.75,40.25 | STM32.35 v30.01,48.47 | v30.01,48.47 | C7.2 C16.1 30.52,49.37 v30.01,48.47 | SN65.2 37.76,48.55 v38.37,49.16
  Top 0.305: C3.2 v17.91,38.36 | C17.1 v54.45,22.29 | STM32.20 v28.01,43.25 | R23.1 v5.74,16.91 | R11.1 10.11,19.15 C19.1 | STM32.23 29.52,40.45 v29.79,40.18 | MPU.25 46.5,39.1 | v18.7,44.93 18.13,44.93 R2.1 | BTN_A.7 7.88,11.04 v7.84,11.04
  Top 0.406: v50.77,20.71 50.14,20.75 R24.1 | BTN_C.7 47.77,21.84 47.34,24.85 C41.- | R12.1 v35.42,29.27 | C18.1 v39.56,24.5 R21.1 | R22.1 v53.79,19.04 | C4.2 47.63,41.29 48.41,42.06 49.58,42.06 R15.2 50.39,41.29 C20.1 52.55,40.52 52.55,39.25 52.03,38.73 R13.2 | C13.1 46.08,41.09 v46.31,41.32 | v46.91,45.44 45.69,46.66 C11.2 | C58.1 8.21,36.71 v9.5,38 C9.2 11.07,41.02 D4.A
  Top 0.508: R25.1 9.97,30.18 9.61,30.6 9.15,31.14 C6.2 C2.2 C58.1 | R11.1 10.93,22.15 C39.- | D4.A 12.19,42.28 12.19,43.63 | 12.16,43.66 v11.88,43.94
  Top 0.61: 16.77,29.88 16.99,27.36 ME311.2 | BTN_C.7 v47.75,21.63 | v33.23,25.63 BTN_B.7 31.37,23.75 | C25.2 19.56,16.72 v18.8,16.72 | C58.1 v7.01,34.27 | v9.27,30.38 9.61,30.6 | D1.A 39.91,39.98 v40.69,39.2 | U$1.1 16.41,30.77 16.41,30.23
  Top 0.813: v16.41,30.35 16.41,30.23 16.77,29.88
  Route2 0.305: 27.51,48.35 v26.05,48.28 v24.45,46.21 23.17,44.93 v18.7,44.93 | 27.51,48.35 v30.01,48.47 | v22.22,52.02 25.27,52.02 | 27.51,48.35 27.51,49.78 25.27,52.02 | v11.88,43.94 17.71,43.94 v18.7,44.93 | v17.69,48.69 18.7,47.68 v18.7,44.93 | v23.75,40.25 25.01,40.25 v28.01,43.25 29.79,41.47 v29.79,40.18 | v46.73,34.27 46.73,32.81 v51.58,27.96 49.51,25.89 v48.31,25.89 | v7.84,11.04 7.84,14.81 v5.74,16.91 10.99,22.16 10.99,22.5 | v4.36,23.38 10.33,23.38 v10.99,22.72 | C1.2 16.41,26.33 v16.41,30.35 | v47.75,21.63 43.95,17.83 39.58,17.83 35.02,13.27 35.02,12.48 36.4,11.1 v36.4,4.37 | v46.91,45.44 46.91,41.92 v46.31,41.32 | J1.4 25.84,52.59 25.27,52.02
  Route2 0.406: 52.12,20.71 v50.77,20.71 49.85,21.63 v47.75,21.63 48.31,22.19 v48.31,25.89 | 52.12,20.71 v53.79,19.04 | 52.12,20.71 52.87,20.71 v54.45,22.29 | v33.23,25.63 35.42,27.82 35.42,28 | 35.42,28 v35.42,29.27 38.31,32.16 v39.5,32.16 | v38.37,49.16 38.37,51.13 37,52.5 37,53.5 36.13,54.37 v35.9,54.37 | v28.01,43.25 25.05,46.21 v24.45,46.21 | v40.69,39.2 42.81,41.32 v46.31,41.32 46.73,40.9 v46.73,34.27 | v13.8,51.13 11.88,49.21 v11.88,43.94 | v39.56,24.5 36.06,28 35.42,28 | J2.4 17.13,31.07 v16.41,30.35 11,30.35 | v17.91,38.36 17.91,43.74 17.71,43.94 | v18.8,16.72 21.01,18.93 C1.2 | v5.97,31.04 6.63,30.38 v9.27,30.38 9.3,30.35 11,30.35 | 10.99,22.5 v10.99,22.72 10.99,30.34 11,30.35
  Bottom 0.254: J1.4 28.02,53.52 | 28.02,53.52 28.23,53.37 | v48.31,25.89 35.61,14.68 35.22,13.76 34.67,13.16 34.41,11.94 | 28.02,53.52 35.05,53.52 v35.9,54.37 | v18.8,16.72 20.46,16.72 24.79,12.39
  other vias: 21.01,21.73 39.5,33.69 41.18,34.19 42.92,34.23 44.74,34.26
  pour Bottom (isolate 0.406): -0.5,29.5 -0.5,58.5 57.5,58.5 57.5,0 -0.5,0
  pour Top (isolate 0.406, no thermals): 38.5,30.5 38.5,35 48.5,35 48.5,31 44,31 44,30 38.5,30
  pour Top (isolate 0.406): -6.5,4.5 -6.5,58.5 61.5,58.5 61.5,-2 0,-2
  pour Route2 (isolate 0.406): 63.5,62 63.5,-3.5 -10.5,-3.5 -10.5,62
HALL_A
  Top 0.254: R5.1 J1.1
  Top 0.305: STM32.43 27.03,51.61 30.06,51.63 30.8,52.08 R5.1
HALL_B
  Top 0.254: R4.1 J1.2
  Top 0.305: STM32.45 26.03,51.7 26.5,52.12 29.61,52.11 R4.1
HALL_C
  Top 0.305: 25.49,52.77 R3.1 | STM32.46 25.52,52.74
  Top 0.406: 25.52,52.74 25.49,52.77 | R3.1 27.2,53.97 J1.3
IS_A  (via drill 0.35, 0.45)
  Top 0.254: STM32.14 25.02,42.86 24.73,43.15 24.73,43.47
  Top 0.305: v29.56,43.52 28.97,44.11 25.37,44.11 24.73,43.47
  Top 0.406: 53.75,20.16 C17.2 v54.61,20.14
  Top 0.61: BTN_C.2 52.08,16.91 R22.2 52.22,17.36 52.95,19.38 C17.2
  Route15 0.305: 40.98,42 39.91,42.42 v29.56,43.52
  Route15 0.406: v54.61,20.14 55.32,22.08 55.88,26.52 55.91,26.77 55.89,27.6 55.71,29.57 55.53,30.17 55.53,30.33 53.04,32.82 53.04,34.45 47.66,39.83 40.98,42 | 40.98,42
IS_B  (via drill 0.35, 0.45 layers 15-16)  (1 unrouted)
  Top 0.305: STM32.15 25.54,43.31
  Top 0.406: C18.2 37.75,23.77 | 36.86,20.15 BTN_B.2 38.04,21.12 38.04,23.73 C18.2 | v38.19,27.94 R21.2 38.02,24 C18.2
  Top 0.508: v25.6,43.31 25.54,43.31
  Route15 0.305: 35.4,39 35.79,39.81 33.89,40.08 v25.6,43.31
  Route15 0.406: v38.19,27.94 38.07,28.69 37.69,30.05 | 37.69,30.05 37.65,30.19 | 35.4,39.44 35.4,39 35.4,32.34 37.69,30.05
IS_C  (via drill 0.35, 0.45)
  Top 0.305: STM32.16 26.04,40.88 24.25,40.88 23.54,41.08 v23.14,41.23
  Top 0.406: BTN_A.2 C19.2 9.15,17.97 R11.2 v7.93,20.21
  Route15 0.305: 21.48,40 17.82,40 16.91,40.91 11,40.91 | 21.48,40 21.55,40 | v23.14,41.23 21.48,40
  Route15 0.406: 11,40.91 4.26,36.9 3.24,34.03 3.24,29.19 8.44,23.99 8.44,20.72 v7.93,20.21
N$1
  Top 0.203: R13.1 50.43,38.3 MPU.9
N$2  (via drill 0.35, 0.35 layers 1-2)
  Top 0.305: STM32.44 26.52,49.36 v26.8,49.08
  Route2 0.305: v26.8,49.08 26.69,49.19 18.56,49.19 18.23,49.52 17.5,49.52 R2.2
  other vias: 16.28,48.3
N$3
  Top 0.203: MPU.10 50.71,38.7 C20.2
N$4  (via drill 0.35)
  Top 0.203: R27.1 41.6,38.86 v42.12,38.86
  Top 0.254: MPU.22 44.61,38.3 44.31,38.6 42.38,38.6 v42.12,38.86
N$6
  Top 2.184: 31.31,3.62 31.97,3.5 31.32,1.79
N$26
  Top 0.61: BTN_C.4 R24.2
N$27
  Top 0.406: BTN_B.6 34.52,24.79 34.52,26.03 33.91,26.64 R14.2
N$28
  Top 0.406: BTN_B.4 36.3,22.97 36.3,23.97 35.71,24.56 R12.2
N$29
  Top 0.406: BTN_A.6 R19.2
N$30
  Top 0.406: BTN_A.4 8.36,15.2 R23.2
N$31
  Top 0.406: BTN_B.3 37.02,21.89 37.02,26.44 R18.2
N$37
  Top 0.406: BTN_A.3 R20.2
N$38
  Top 0.203: C13.2 44.75,39.5 MPU.19
N$48
  Top 0.203: MPU.11 49.54,39.1 R15.1
N$51
  Top 0.254: 19.56,53.86 18.63,53.47 CR.3 18.31,53.47 | 19.56,53.86 C15.2 | STM32.5 21.8,46.95 21.82,50.11 19.56,53.86
N$52
  Top 0.254: C14.2 CR.1 20.29,50.85 21.23,49.91 21.23,46.54 21.34,46.43 STM32.6
N$54
  Top 0.254: C12.2 R6.2 20.16,45.97 STM32.7
N$56
  Top 0.406: BTN_C.6 48.57,20.67 R9.2
N$57
  Top 0.406: BTN_C.3 51.49,18.39 51.95,18.96 R10.2
N$61
  Top 0.254: R7.1 R8.2 27.51,39.98 STM32.19
N$62
  Top 0.61: C60.2 17.84,26.02 ME311.1
N$63
  Top 0.508: ME311.3 C61.1 12.99,28.52 | 12.99,28.52 R25.2 | 12.99,28.52 11.93,30.1 R26.1
N$64
  Top 0.61: R65.1 ME311.4
N$66
  Top 0.61: ME311.6 16.08,24.14 C60.1 20.67,23.69 20.61,26.41 20.61,28.65 U$1.2 20.11,30.14 16.5,33.75
  Top 0.813: 16.5,33.75 U$23.P$2
PHASE_A  (via drill 0.4 pad 0.6)  (1 unrouted)
  Top 0.254: v31.93,4.13 v30.88,3.96 v30.87,2.74 v31.94,2.83 v31.98,1.63 v30.87,1.56
  Top 0.813: 35.31,8.84 38,9 BTN_C.8
  Top 2.54: v31.93,4.13 33.06,7.59 35.31,8.84 36.37,9.44
  Bottom 1.422: v30.88,3.96 v30.87,1.56 v31.98,1.63 v31.93,4.13 v30.88,3.96
PHASE_B  (via drill 0.4 pad 0.6)  (2 unrouted)
  Top 0.254: v29.04,1.82 v27.89,1.81 v27.89,2.97 v29,2.96 v28.97,4.07 v27.93,4.05
  Top 0.813: BTN_B.8 28.35,8.56
  Top 1.016: 27.93,7.05 v27.93,4.05
  Top 2: 28.46,1.8 28.39,4.05 | 28.36,4.05 v27.93,4.05
  Top 2.54: 28.35,8.56 28.36,4.05
  Bottom 1.422: v27.93,4.05 v27.89,1.81 v29.04,1.82 v28.97,4.07 v27.93,4.05
PHASE_C  (via drill 0.4 pad 0.6)  (3 unrouted)
  Top 0.254: v25.99,2.93 v24.92,2.85 v24.88,4.1 24.91,4.13 v26,4.13
  Top 0.813: BTN_A.8 21.09,5.56
  Top 2.184: 25.29,3.48 25.6,3.36 25.57,1.86
  Top 2.54: 21.09,5.56 22.57,5.2 v24.92,2.85
  Bottom 1.27: 25.5,1.79 v26.01,1.74
  Bottom 1.422: v26,4.13 v24.88,4.1 v25.99,2.93
  Bottom 2.184: v24.88,4.1 25.5,1.79
  other vias: 24.92,1.67
SCL  (via drill 0.35, 0.45)
  Top 0.254: STM32.21 28.5,40.5 v28.19,40.42 28.19,38.06 28.87,37.38 36.38,37.38 v36.71,37.05 | MPU.23 43.66,37.9 v43.64,37.92
  Top 0.406: v20.53,36.05 R16.2
  Route15 0.152: 20.53,34 | 20.53,34
  Route15 0.254: v28.19,40.42 v20.53,36.05 | v36.71,37.05 42.77,37.05 v43.64,37.92
  Route15 0.406: 20.53,34 v20.53,36.05
  Route15 0.508: J2.1 21.09,24.96 21.07,26.58 20.43,27.35 20.53,34
SDA  (via drill 0.35, 0.45)
  Top 0.254: STM32.22 v29.01,39.6 30.74,37.87 36.08,37.87 v36.4,38.19 | v42.08,37.84 42.77,37.15 45.6,37.15 MPU.24
  Top 0.406: v21.95,35.31 R17.2
  Route15 0.203: v29.01,39.6 26.43,38.77 22,36.31 v21.95,35.31
  Route15 0.254: v36.4,38.19 41.73,38.19 v42.08,37.84
  Route15 0.406: 21.33,34.77 v21.95,35.31
  Route15 0.508: J2.2 21.27,27.86 21.33,34.77
SLEEP_A  (via drill 0.35, 0.45)
  Top 0.305: v32.87,45.18 32.06,45.42 STM32.29 | v40.73,41.15 39.55,42.33 36.48,43.98 v35.47,43.98
  Top 0.406: R10.1 v54.68,23.37
  Route15 0.305: v35.47,43.98 34.07,43.98 v32.87,45.18
  Route15 0.406: v54.68,23.37 55.2,26.47 | 55.2,26.47 55.24,26.72 | 55.2,26.47 55.31,27.4 55.06,29.63 54.26,30.73 53.73,31.15 52.42,31.86 50.07,35.54 | 50.07,35.54 49.89,35.82 | 50.07,35.54 47.73,38.85 v40.73,41.15
SLEEP_B  (via drill 0.35)
  Top 0.305: v33.92,38.8 33.62,45.92 STM32.30
  Top 0.406: R18.1 v37.02,29.64
  Route15 0.406: v37.02,29.64 34.66,31.04 34.66,38.06 v33.92,38.8
SLEEP_C  (via drill 0.35, 0.45)
  Top 0.305: v19.35,40.64 v20.9,42.23 | v29.79,46.48 STM32.31
  Top 0.406: R20.1 v7.01,20.15
  Route15 0.305: 10.92,41.71 17,41.71 18.07,40.64 v19.35,40.64 | v20.9,42.23 21.8,42.23 25.45,45.88 29.19,45.88 v29.79,46.48
  Route15 0.406: v7.01,20.15 7.66,22.9 | 7.66,22.9 7.69,23.03 | 10.92,41.71 3.52,37.28 2.51,34.37 2.51,28.36 7.66,23.21 7.66,22.9
SWCLK  (via drill 0.45)
  Top 0.254: STM32.37 v30.46,50.97 | v35.96,52.64 36.74,52.66 36.75,53.32 35.23,53.32 35.24,52.09 36.74,52.09 36.74,52.58 36.67,52.31 35.44,52.29 35.44,53.11 36.55,53.11 36.57,52.52 35.67,52.5 35.61,52.96 36.35,52.96 36.38,52.8 35.78,52.79 35.8,52.69
  Route15 0.254: v30.46,50.97 34.95,52.2 | 34.95,52.2 35.07,52.23 | 34.95,52.2 v35.96,52.64
SWDIO
  Top 0.254: STM32.34 32.93,47.92 35.14,49.28 36.73,49.28 36.72,49.83 35.22,49.83 35.22,48.6 36.73,48.6 36.73,49.64 35.41,49.71 35.45,48.79 36.56,48.79 36.55,49.49 35.61,49.49 35.63,48.98 36.45,49 36.45,49.13 35.78,49.13
VIN  (via drill 1)
  Top 0.203: D5.C 41.8,25.07
  Top 0.406: v42.35,25.6 41.82,25.07 41.8,25.07 | 38,17.5 37.75,17.75 BTN_B.1
  Top 0.61: C39.+ 16.07,19.3 | 9.89,26.95 C40.+
  Top 0.813: 52.41,15.04 51.72,15.04 BTN_C.1 | 14.2,23.84 ME311.5 | 13.56,17.81 12.52,17.81 BTN_A.1
  Top 1.016: C41.+ 43.52,20.65 | C39.+ 16.35,21.69 14.2,23.84 13.09,24.6 R65.2
  Top 1.27: C59.2 40.41,27.63 D5.C C10.1 C8.1 | 49.48,11.86 52.29,14.79 52.41,15.04 | 28.24,22.73 26.23,22.73 26,22.5 | 22.61,19.14 22.25,19.5 17.16,19.5 C39.+ 16.35,19.85 C1.1 | R65.2 C40.+
  Top 2.54: C41.+ 42.71,21.4 D5.C | C41.+ 42.82,17.25 48.08,11.07 48.68,11.07 49.48,11.86 | C41.+ 40.51,18.98 39.74,18.98 38.26,17.5 38,17.5 37,16.5 34.38,16.5 33.45,17.43 28.24,22.73 | 26,22.5 24.5,21 22.61,19.14 C25.1 | C39.+ 15.47,17.81 13.56,17.81

### Text on the board
tNames: GND | CH | SW | 3.3 | SD | CL | GND | +
bNames: Curator - Krestovnikov / Designer - Luzhetsky / Board version - 0.2 | SERV